# EAGLE design OhmMeter (EAGLE 9.6.2)
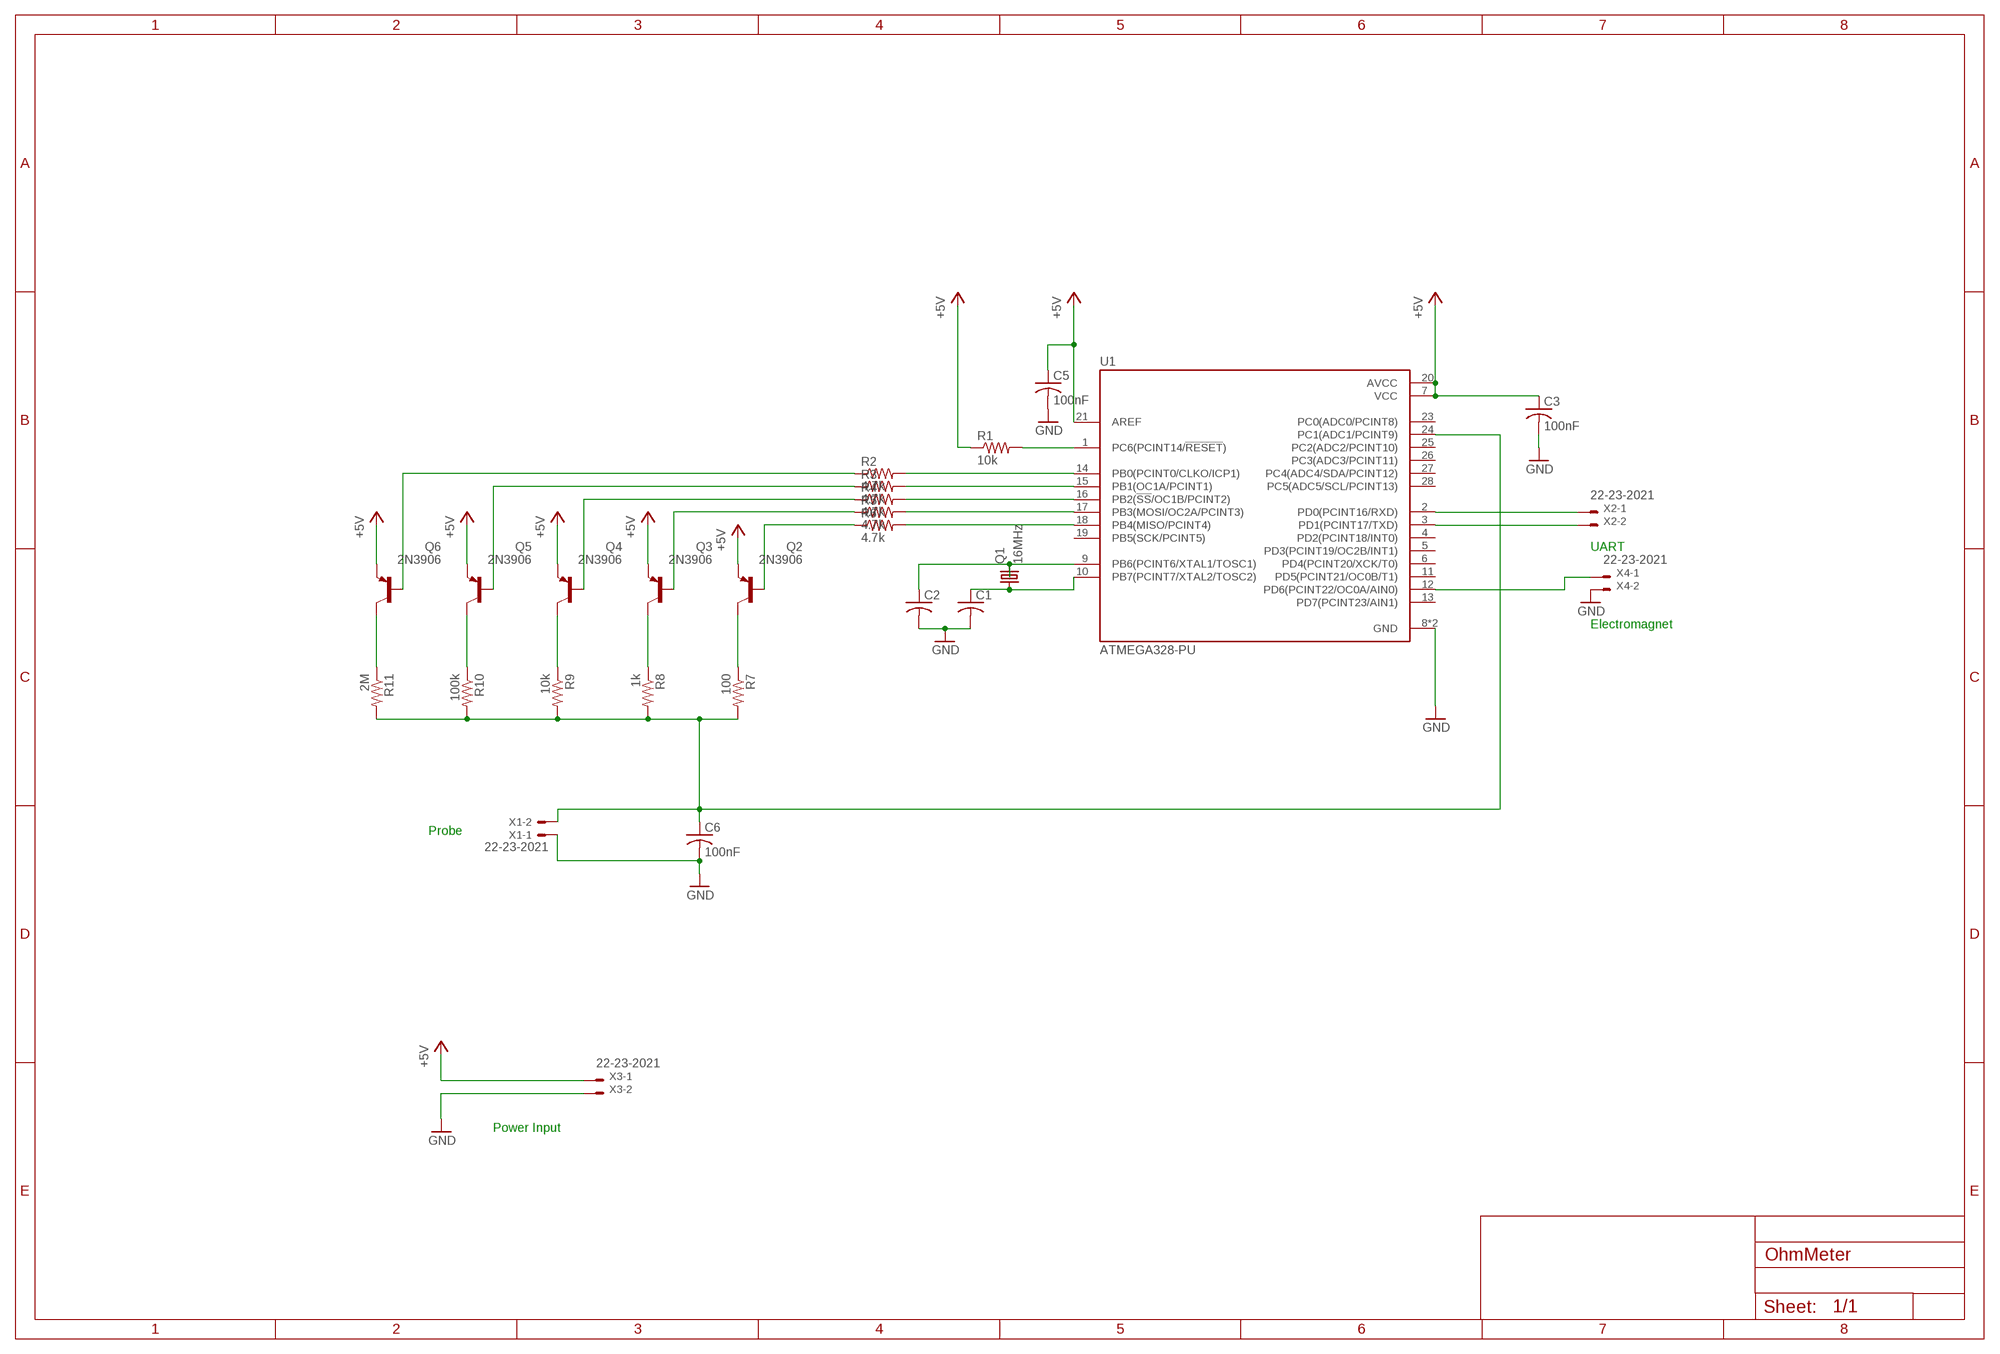
[diagram p0: schematic, sheet 1]

## Parts
C1  C-US025-024X044  [C025-024X044]
C2  C-US025-024X044  [C025-024X044]
C3  100nF  C-US025-024X044  [C025-024X044]
C5  100nF  C-US025-024X044  [C025-024X044]
C6  100nF  C-US025-024X044  [C025-024X044]
Q1  16MHz  CRYSTALHC49S  [HC49/S]
Q2  2N3906  [TO92]
Q3  2N3906  [TO92]
Q4  2N3906  [TO92]
Q5  2N3906  [TO92]
Q6  2N3906  [TO92]
R1  10k  R-US_0204/5  [0204/5]
R2  4.7k  R-US_0204/5  [0204/5]
R3  4.7k  R-US_0204/5  [0204/5]
R4  4.7k  R-US_0204/5  [0204/5]
R5  4.7k  R-US_0204/5  [0204/5]
R6  4.7k  R-US_0204/5  [0204/5]
R7  100  R-US_0204/5  [0204/5]
R8  1k  R-US_0204/5  [0204/5]
R9  10k  R-US_0204/5  [0204/5]
R10  100k  R-US_0204/5  [0204/5]
R11  2M  R-US_0204/5  [0204/5]
U1  ATMEGA328-PU  [DIP787W46P254L3467H508Q28]
X1  22-23-2021  [22-23-2021]
X2  22-23-2021  [22-23-2021]
X3  22-23-2021  [22-23-2021]
X4  22-23-2021  [22-23-2021]

## Nets
+5V: C3.1 C5.1 Q2.3(E) Q3.3(E) Q4.3(E) Q5.3(E) Q6.3(E) R1.1 U1.7(VCC) U1.20(AVCC) U1.21(AREF) X3.1
GND: C1.2 C2.2 C3.2 C5.2 C6.2 U1.8(GND) U1.22(GND) X1.1 X3.2 X4.2
N$1: C2.1 Q1.2 U1.9(PB6(PCINT6/XTAL1/TOSC1))
N$2: C1.1 Q1.1 U1.10(PB7(PCINT7/XTAL2/TOSC2))
N$3: R6.2 U1.18(PB4(MISO/PCINT4))
N$4: R5.2 U1.17(PB3(MOSI/OC2A/PCINT3))
N$5: R4.2 U1.16(PB2(!SS!/OC1B/PCINT2))
N$6: R3.2 U1.15(PB1(OC1A/PCINT1))
N$7: R2.2 U1.14(PB0(PCINT0/CLKO/ICP1))
N$8: R1.2 U1.1(PC6(PCINT14/!RESET!))
N$9: Q2.2(B) R6.1
N$10: Q3.2(B) R5.1
N$11: Q4.2(B) R4.1
N$12: Q5.2(B) R3.1
N$13: Q2.1(C) R7.1
N$14: Q6.2(B) R2.1
N$15: Q3.1(C) R8.1
N$16: Q4.1(C) R9.1
N$17: Q5.1(C) R10.1
N$18: Q6.1(C) R11.1
N$19: C6.1 R7.2 R8.2 R9.2 R10.2 R11.2 U1.24(PC1(ADC1/PCINT9)) X1.2
N$20: U1.2(PD0(PCINT16/RXD)) X2.1
N$21: U1.3(PD1(PCINT17/TXD)) X2.2
N$22: U1.12(PD6(PCINT22/OC0A/AIN0)) X4.1
Unconnected: U1.4(PD2(PCINT18/INT0)) U1.5(PD3(PCINT19/OC2B/INT1)) U1.6(PD4(PCINT20/XCK/T0)) U1.11(PD5(PCINT21/OC0B/T1)) U1.13(PD7(PCINT23/AIN1)) U1.19(PB5(SCK/PCINT5)) U1.23(PC0(ADC0/PCINT8)) U1.25(PC2(ADC2/PCINT10)) U1.26(PC3(ADC3/PCINT11)) U1.27(PC4(ADC4/SDA/PCINT12)) U1.28(PC5(ADC5/SCL/PCINT13))

## Notes on the sheet
- UART
- Electromagnet
- Probe
- Power Input

## Library data of the parts
C1-C3 C5 C6 = adafruit:C-US: CAPACITOR, American symbol
Q1 = adafruit:CRYSTAL: CRYSTAL; OC_FARNELL: 1667008; OC_NEWARK: unknown
Q2-Q6 = transistor-pnp:2N3906: PNP Transistor
R1-R11 = adafruit:R-US_: RESISTOR, American symbol
U1 = ATMEGA328-PU:ATMEGA328-PU: AVR AVR® ATmega Microcontroller IC 8-Bit 20MHz 32KB (16K x 16) FLASH 28-PDIP Check availability <https://pricing.snapeda.com/parts/ATMEGA328-PU/Microchip%20Technology/view-part?ref=eda>; AVAILABILITY: In Stock; DESCRIPTION: AVR AVR® ATmega Microcontroller IC 8-Bit 20MHz 32KB (16K x 16) FLASH 28-PDIP; MF: Microchip Technology; MP: ATMEGA328-PU; PACKAGE: DIP-28 Microchip Technology; PRICE: None; PURCHASE-URL: https://pricing.snapeda.com/search/part/ATMEGA328-PU/?ref=eda
X1-X4 = con-molex:22-23-2021: .100" (2.54mm) Center Header - 2 Pin; MF: MOLEX; MPN: 22-23-2021; OC_FARNELL: 1462926; OC_NEWARK: 25C3832

## Board
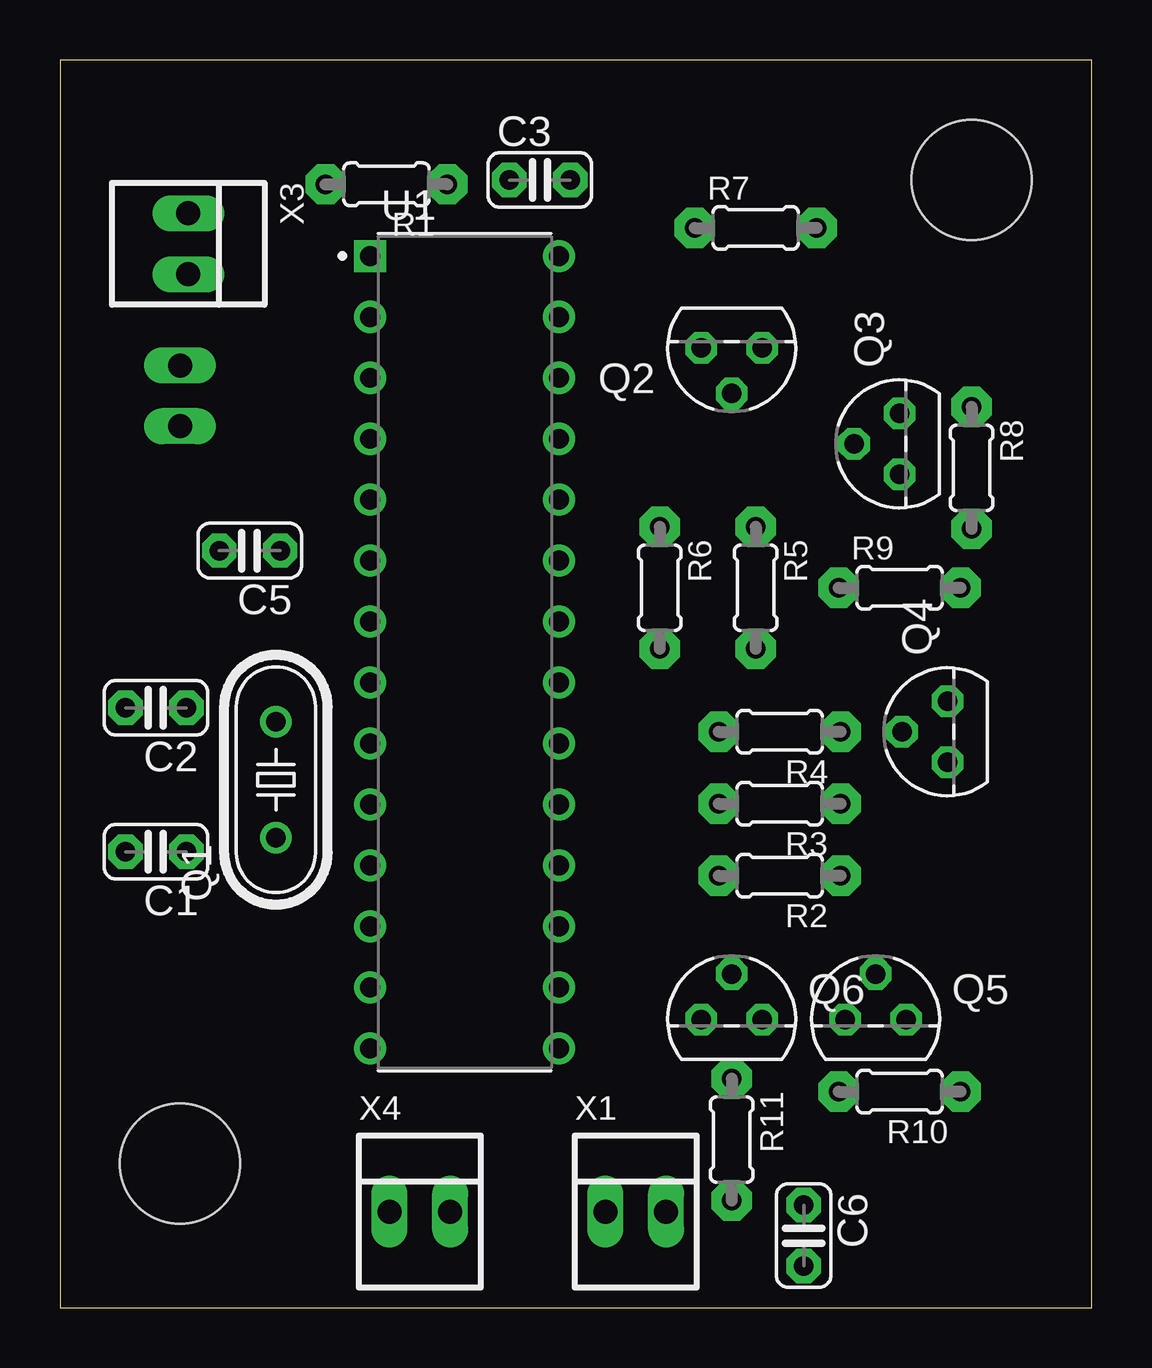
[diagram p1: board, top side]
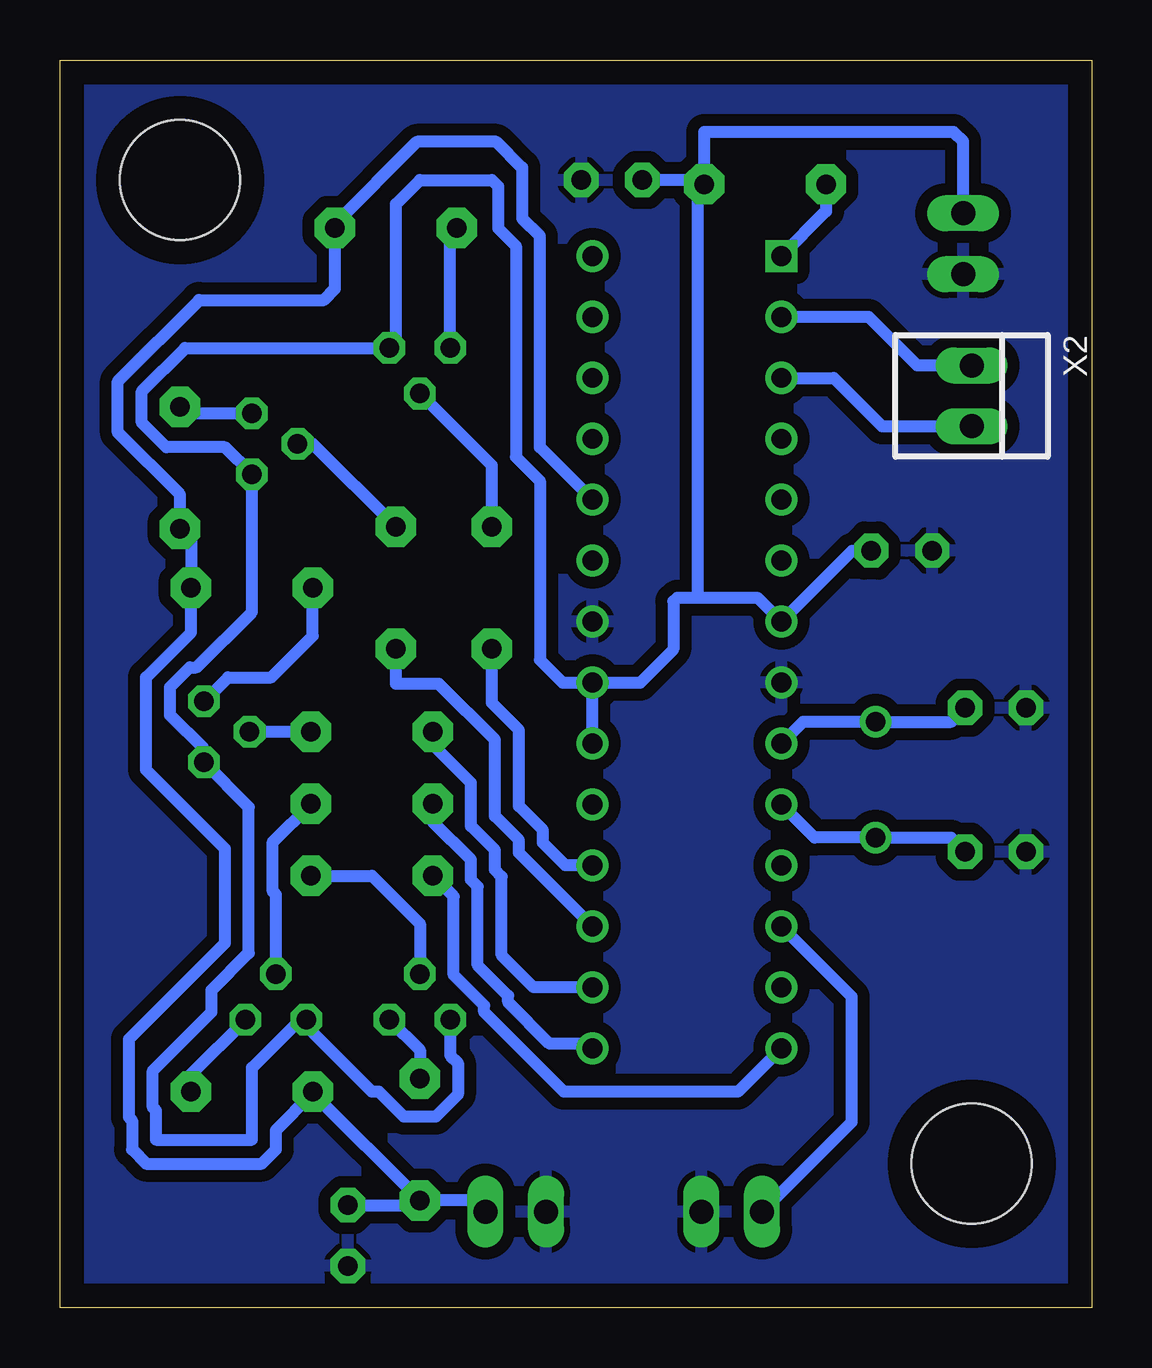
[diagram p2: board, bottom side, seen from below]

Size 43 x 52 mm. Coordinates in mm from the lower left corner, seen from the top.
Outline: 0,0 43,0 43,52 0,52 0,0
Copper layers (1*16): Top 0.035mm / dielectric 1.5mm / Bottom 0.035mm
Design rules "UWE_Router_Std_SS&DS": minimum track width 0.5mm, minimum drill 0.7mm, track to track 0.5mm, track to pad 0.5mm, pad to pad 0.5mm, via to via 0.5mm, smd to smd 0.5mm, copper to edge 1mm, drill to drill 0.2mm, minimum pad ring 10mil, minimum via ring 8mil, stop-mask expansion 4mil, vias tented up to drill 0mil, thermal gap 0.25mm
Holes 5 mm at 38,47 5,6

### Footprints (pad centres in the part's own frame; a part is rotated, then mirrored left to right if it is on the bottom)
C025-024X044 = drill 0.813 pad 1.422 octagon: 1 -1.27,0; 2 1.27,0
HC49/S = drill 0.813: 1 -2.413,0; 2 2.413,0
TO92 = drill 0.813 octagon: 1 1.27,0; 2 0,1.905; 3 -1.27,0
0204/5 = drill 0.813 pad 1.676 octagon: 1 -2.54,0; 2 2.54,0
DIP787W46P254L3467H508Q28 = drill 0.83 pad 1.25 square: 1 -3.937,16.51 | drill 0.83 pad 1.25: 2 -3.937,13.97; 3 -3.937,11.43; 4 -3.937,8.89; 5 -3.937,6.35; 6 -3.937,3.81; 7 -3.937,1.27; 8 -3.937,-1.27; 9 -3.937,-3.81; 10 -3.937,-6.35; 11 -3.937,-8.89; 12 -3.937,-11.43; 13 -3.937,-13.97; 14 -3.937,-16.51; 15 3.937,-16.51; 16 3.937,-13.97; 17 3.937,-11.43; 18 3.937,-8.89; 19 3.937,-6.35; 20 3.937,-3.81; 21 3.937,-1.27; 22 3.937,1.27; 23 3.937,3.81; 24 3.937,6.35; 25 3.937,8.89; 26 3.937,11.43; 27 3.937,13.97; 28 3.937,16.51
22-23-2021 = drill 1 long: 1 -1.27,0; 2 1.27,0

### Placement (x,y rotation side)
C1  4,19 180 top
C2  4,25 180 top
C3  20,47 0 top
C5  7.91,31.55 180 top
C6  31,3 270 top
Q1  9,22 90 top
Q2  28,40 180 top
Q3  35,36 90 top
Q4  37,24 90 top
Q5  34,12 0 top
Q6  28,12 0 top
R1  13.61,46.82 180 top
R2  30,18 180 top
R3  30,21 180 top
R4  30,24 180 top
R5  29,30 270 top
R6  25,30 270 top
R7  29,45 0 top
R8  38,35 270 top
R9  35,30 0 top
R10  35,9 180 top
R11  28,7 270 top
U1  16.87,27.32 0 top
X1  24,4 0 top
X2  5,38 270 bottom
X3  5.35,44.34 270 top
X4  15,4 0 top

### Tracks (layer width: path | path; a pad name or v marks a point on that pad's centre or on a via)
+5V
  Bottom 0.5: 33,12 35,10 35,7 39,7 39,8.21 39.13,8.34 39.13,9.87 36.68,12.32 36.68,13.22 35.13,14.77 35.13,20.86 Q4.3 37,23.27 38.41,24.69 38.41,25.85 37.58,26.68 37.32,26.68 35,29 Q3.3 36.13,35.86 38.57,35.86 39.59,36.88 39.59,38.2 37.79,40 Q2.3 29,40.27 29,46 28,47 25,47 24.73,46.73 24.73,44.98 24,44.25 24,35.45 23,34.45 23,27 22.05,26.05 U1.21 | 33,12 Q5.3 | Q6.3 26.73,10.52 26.41,10.2 26.41,8.88 27.34,7.95 28.66,7.95 29.71,9 30,9 33,12 | U1.20 U1.21 | U1.21 18.81,26.05 17.43,27.43 17.43,29.43 17.27,29.59 16.43,29.59 | 16.43,29.59 13.93,29.59 U1.7 9.97,31.55 C5.1 | R1.1 16.33,47 C3.1 | R1.1 16.43,46.54 16.43,29.59 | X3.1 5.35,48.61 5.74,49 16.15,49 R1.1
GND
  pour Bottom: -1,0 1,-2 42,-2 44,0 44,51 42,53 1,53 -1,51
N$1
  Bottom 0.5: U1.9 12.03,24.41 Q1.2 5.86,24.41 C2.1
N$2
  Bottom 0.5: U1.10 11.55,19.59 Q1.1 5.86,19.59 C1.1
N$3
  Bottom 0.5: U1.18 21.93,18.43 22.87,19.37 22.87,19.9 23.87,20.9 23.87,24.07 25,25.2 R6.2
N$4
  Bottom 0.5: R5.2 29,26 27.21,26 24.87,23.66 24.87,20.49 23.87,19.49 23.87,18.95 U1.17
N$5
  Bottom 0.5: U1.16 23.26,13.35 24.59,14.68 24.59,17.96 24.87,18.24 24.87,19.07 25.87,20.07 25.87,21.87 27.46,23.46 R4.2
N$6
  Bottom 0.5: U1.15 21,11 22.59,11 24.32,12.73 24.32,13 25.59,14.27 25.59,17.54 25.87,17.83 25.87,18.66 27.46,20.25 R3.2
N$7
  Bottom 0.5: U1.14 14.74,9 22,9 25.32,12.32 25.32,12.58 26.59,13.85 26.59,17.13 R2.2
N$8
  Bottom 0.5: R1.2 11.07,45.69 U1.1
N$9
  Bottom 0.5: R6.1 25,35.09 Q2.2
N$10
  Bottom 0.5: R5.1 32.46,36 Q3.2
N$11
  Bottom 0.5: R4.1 Q4.2
N$12
  Bottom 0.5: Q5.2 34,17.21 34.13,17.34 34.13,19.41 R3.1
N$13
  Bottom 0.5: Q2.1 26.73,44.73 R7.1
N$14
  Bottom 0.5: R2.1 30,18 28,16 Q6.2
N$15
  Bottom 0.5: Q3.1 37.73,37.27 R8.1
N$16
  Bottom 0.5: Q4.1 36,26.27 34.19,26.27 32.46,28 R9.1
N$17
  Bottom 0.5: R10.1 37.54,9.73 Q5.1
N$18
  Bottom 0.5: Q6.1 28,10.73 R11.1
N$19
  Bottom 0.5: R11.2 32.46,8.92 | 32.46,8.92 R10.2 | X1.2 25.73,4.46 R11.2 | U1.24 23,35.86 23,44.66 23.73,45.4 23.73,47.52 24.8,48.59 28.12,48.59 31.54,45.17 R7.2 31.54,42.46 32,42 37.2,42 40.59,38.61 40.59,36.47 38,33.88 R8.2 37.54,32 R9.2 37.54,28.14 39.41,26.27 39.41,22.41 36.13,19.13 36.13,15.19 40.13,11.19 40.13,7.93 40,7.8 40,6.59 39.41,6 34.59,6 34,6.59 34,7.38 32.46,8.92 | C6.1 28.19,4.27 R11.2
N$20
  Bottom 0.5: X2.1 7.27,39.27 9.29,41.29 U1.2
N$21
  Bottom 0.5: U1.3 10.75,38.75 8.73,36.73 X2.2
N$22
  Bottom 0.5: X4.1 10,7.73 10,12.96 U1.12